# Altium schematic sheet triac.SchDoc
size A4; SheetNumber: 1; SheetTotal: 1; SPICEModelCacheZXQXGXKZ: <root> / <DocumentId>ZXQXGXKZ</DocumentId> / </root>
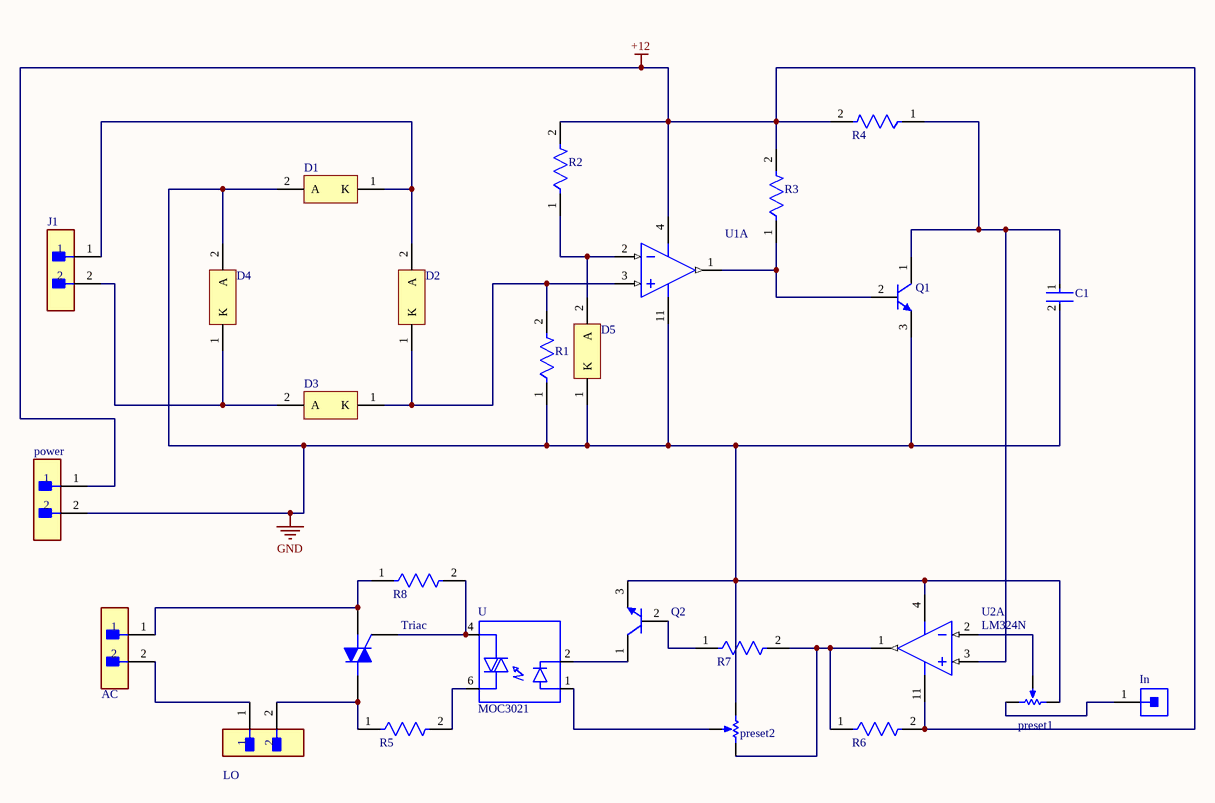
[diagram p0: triac.SchDoc]

## Parts
AC  M20-9990246  [FP-M20-9990246-MFG]  (value not drawn)
C1  RCE5C1H332J0M1H03A  [FP-RCE0K1-MFG]  (value not drawn)
D1  1N4007G  [ONSC-AXIAL_LEAD-2-59-10_P]  (value not drawn)
D2  1N4007G  [ONSC-AXIAL_LEAD-2-59-10_P]  (value not drawn)
D3  1N4007G  [ONSC-AXIAL_LEAD-2-59-10_P]  (value not drawn)
D4  1N4007G  [ONSC-AXIAL_LEAD-2-59-10_P]  (value not drawn)
D5  1N4007G  [ONSC-AXIAL_LEAD-2-59-10_P]  (value not drawn)
In  61300111121  [61300111121]  (value not drawn)
J1  M20-9990246  [FP-M20-9990246-MFG]  (value not drawn)
LO  M20-9990246  [FP-M20-9990246-MFG]  (value not drawn)
power  M20-9990246  [FP-M20-9990246-MFG]  (value not drawn)
preset1  3362P-1-103LF  [BOUR-3362P]  (value not drawn)
preset2  3362P-1-103LF  [BOUR-3362P]  (value not drawn)
Q1  BC547BG  [ONSC-TO-92-3-29-11]  (value not drawn)
Q2  BC547BG  [ONSC-TO-92-3-29-11]  (value not drawn)
R1  MFR-25FBF52-1K18  [FP-MFR-25-MFG]  (value not drawn)
R2  MFR-25FBF52-1K18  [FP-MFR-25-MFG]  (value not drawn)
R3  MFR-25FBF52-1K18  [FP-MFR-25-MFG]  (value not drawn)
R4  MFR-25FBF52-1K18  [FP-MFR-25-MFG]  (value not drawn)
R5  MFR-25FBF52-1K18  [FP-MFR-25-MFG]  (value not drawn)
R6  MFR-25FBF52-1K18  [FP-MFR-25-MFG]  (value not drawn)
R7  MFR-25FBF52-1K18  [FP-MFR-25-MFG]  (value not drawn)
R8  MFR-25FBF52-1K18  [FP-MFR-25-MFG]  (value not drawn)
Triac  Triac  [369-03]  (value not drawn)
U  MOC3021  [DIP762W45P254L889H508Q6]
U1  LM324N  [N0014A]  (value not drawn)  (part A of 4)
U2  LM324N  [N0014A]  (part A of 4)

## Nets
+12: power.1 R2.2 R3.2 R4.2 R6.2 U1.4(V+) U2.11(GND)
GND: C1.2 D1.2(A) D4.2(A) D5.1(K) power.2 preset1.1(CCW) preset2.1(CCW) Q1.3(E) Q2.3(E) R1.1 U1.11(GND) U2.4(V+)
NetAC_1: AC.1 R8.1 Triac.1(M1)
NetAC_2: AC.2 LO.1
NetC1_1: C1.1 Q1.1(C) R4.1 U2.3(IN1+)
NetD1_1: D1.1(K) D2.2(A) J1.1
NetD2_1: D2.1(K) D3.1(K) R1.2 U1.3(IN1+)
NetD3_2: D3.2(A) D4.1(K) J1.2
NetD5_2: D5.2(A) R2.1 U1.2(IN1-)
NetIn_1: In.1 preset1.3(CW)
NetLO_2: LO.2 R5.1 Triac.2(M2)
Netpreset1_2: preset1.2(S) U2.2(IN1-)
Netpreset2_2: preset2.2(S) U.1(ANODE)
Netpreset2_3: preset2.3(CW) R6.1 R7.2 U2.1(OUT1)
NetQ1_2: Q1.2(B) R3.1 U1.1(OUT1)
NetQ2_1: Q2.1(C) U.2(CATODE)
NetQ2_2: Q2.2(B) R7.1
NetR5_2: R5.2 U.6(MAIN_TERM1)
NetR8_2: R8.2 Triac.3(G) U.4(MAIN_TERM2)

## Library data of the parts
AC J1 LO power = CMP-15831-000009-1: CONN HEADER VERT 2POS 2.54MM; Manufacturer: Harwin; Conn Gender: Male; Conn Orientation: Vertical; Number Of Contacts: 2; Current Rating: 3A; ComponentLink2URL: https://cdn.harwin.com/pdfs/M20-999.pdf; ComponentLink2Description: Datasheet; Package: M20-9990246; Temperature: -40°C to +105°C; Octopart: https://octopart.com/m20-9990246-harwin-2590635; Mouser Description: 2.54mm (0.1") Pitch SIL Vertical PC Tail Pin Header, 6.1mm mating pin height, tin, 2 contacts; Temperature Range High: +105°C; Device Class L1: Connectors; RoHS: TRUE; Automotive: No; Height: 8.99mm; Number Of Rows: 1; Contact Material: Tin,Nickel; Category: Conn; Pitch: 2.54mm; Lead Free: Yes; Digikey Description: CONN HEADER VERT 2POS 2.54MM; Manufacturer Part Number: M20-9990246; Temperature Range Low: -40°C; Device Class L3: unset; Device Class L2: Headers and Wire Housings
C1 = CMP-06035-032713-1: Cap Ceramic 3.3nF 50V C0G ±5% Radial 5mm +125°C Automotive Bulk; Lead Diameter: 0.5mm; Lead/Base Style: Formed Leads; Voltage Rating (DC): 50V; Dielectric: C0G; Capacitance: 3.3nF; Mount: Through Hole; Width: 0.098inch; Max Operating Temperature: 125°C; Height - Seated (Max): 0.138inch; Packaging: Tape and Reel; Package Quantity: 2000; Case/Package: Radial; Tolerance: 5%; Voltage Rating: 50V; Termination: Radial; Length: 0.142inch; Ratings: AEC-Q200; Lead Pitch: 0.197inch; Min Operating Temperature: -55°C; Height: 3.5mm; Resistor Type: Ceramic
D1-D5 = CMP-0902-00143-1: Standard Recovery Rectifier, 2-Pin Axial_Lead, Pb-Free, Bulk Bag; Manufacturer: On Semiconductor; VRRM Max (V): 1000; IFSM Max (A): 30; IO(rec) Max (A): 1; ComponentLink2Description: Datasheet; ComponentLink2URL: http://www.onsemi.com/pub_link/Collateral/1N4001-D.PDF; PackageDescription: 2-Pin, Axial Lead, Diameter 2.35 mm; PartNumber: 1N4007G; ComponentLink1URL: http://www.onsemi.com/; ComponentLink3URL: http://www.onsemi.cn/pub_link/Collateral/59-10.PDF; PackageReference: AXIAL_LEAD-2-59-10; ComponentLink1Description: Manufacturer URL; Mounting Technology: Through Hole; ComponentLink3Description: Package Specification; Packing: Bulk Bag; PackageVersion: Rev. U, 02/2005; DatasheetVersion: Rev. 13; RoHS: TRUE; Type: Standard Recovery
In = CMP-1502-01058-1: THT Vertical Pin Header WR-PHD, Pitch 2.54 mm, Single Row, 1 pins; Manufacturer: Wurth Elektronik; Gender: Male; Working Voltage: 250VAC; Withstanding Voltage: 500VAC; Pin Number: 1; Contact Resistance: 20mOhm; Rated Current: 3A; Pitch: 2.54mm; Mounting Technology: THT; Datasheet URL: https://katalog.we-online.de/em/datasheet/6130xx11121.pdf; Manufacturer URL: http://www.we-online.de; Operating Temperature: -40to105degC; Publisher: WurthElektronik; Part Number: 61300111121; Row Number: Single; Package Reference: 61300111121; Orientation: Vertical; Packaging: Bag
preset1 preset2 = CMP-1747-00004-1: Square Trimpot(R) Trimming Potentiometer, 10 KOhm, 300 V, -55 to 125 degC, 3-Pin THD, RoHS, Tube; Voltage Rating: 220 mV; Power Rating: 1 W; Tolerance: 1%; Resistance: 50 mohm; Case/Package: 1206; Length: 3.2 mm; RoHSCompliant: True; PackageDescription: 3-Pin Through Hole Device, Body 6.6 x 6.99 mm, Pitch 2.54 mm; ComponentLink2Description: Datasheet; REACH SVHC: No SVHC; Mount: Surface Mount; Height: 0.6 mm; Packaging: Tape and Reel; ComponentLink1URL: http://www.bourns.com/; Case Code (Imperial): 0612; Pins: 2; Case Code (Metric): 1632; ComponentLink2URL: http://www.bourns.com/docs/Product-Datasheets/3362.pdf; Min Operating Temperature: -25degC; ComponentLink1Description: Manufacturer URL; PackageReference: 3326P; Max Operating Temperature: 125degC; Width: 1.6 mm; Package Quantity: 5000; DatasheetVersion: May-16
Q1 Q2 = CMP-1048-01469-1: Amplifier Transistor, NPN Silicon, 3-Pin TO-92, Pb-Free, Bulk Box; Manufacturer: On Semiconductor; IC Continuous (A): 0.1; fT Min (MHz): 150; Packing: Bulk Box; RoHS: TRUE; PackageVersion: Rev. AM; Mounting Technology: Through Hole; Polarity: NPN; PackageReference: TO-92-3-29-11_AM_SL; DatasheetVersion: Rev. 7; ComponentLink2URL: http://www.onsemi.com/pub_link/Collateral/BC546-D.PDF; ComponentLink1Description: Manufacturer URL; ComponentLink3URL: http://www.onsemi.cn/pub_link/Collateral/2N6426-D.PDF; PackageDescription: 3-Pin Transistor Outline, Body 4.825 x 3.685 mm, Pitch 1.27 mm; ComponentLink2Description: Datasheet; ComponentLink1URL: http://www.onsemi.com/; PartNumber: BC547BG; ComponentLink3Description: Package Specification
R1-R8 = CMP-03413-000001-1: RES 1.18K OHM 1/4W 1% AXIAL; Manufacturer: Yageo; Value: 1.18kΩ; Temperature Coefficient: 100ppm/°C; Power Rating: 0.25W; Voltage Rating: 250V; Temperature: -55°C to +155°C; Automotive: No; Temperature Range High: +155°C; Mouser Description: Metal Film Resistors 1.18K OHM 1/4W 1%; Digikey Description: RES 1.18K OHM 1/4W 1% AXIAL; Lead Free: Yes; Tolerance: 1%; ComponentLink2Description: Datasheet; ComponentLink2URL: https://www.yageo.com/upload/media/product/products/datasheet/lr/Yageo_LR_MFR_1.pdf; Temperature Range Low: -55°C; Package: MFR-25; Ipc Land Pattern Name: RESAD1000W75L680D260; Composition: Metal Film; Category: Res; Octopart: https://octopart.com/mfr-25fbf52-1k18-yageo-56251681; Series: MFR; Device Class L2: Resistors; Height: 2.6mm; Resistance: 1.18kΩ; Device Class L3: Through-Hole Resistors; Manufacturer Part Number: MFR-25FBF52-1K18; RoHS: TRUE; Device Class L1: Passive Components
Triac = Triac: Silicon Bidirectional Triode Thyristor; Note: Pin 2 is electrically connected to Pin 4 (TAB); Published: 29-Sep-2000; LatestRevisionDate: 17-Jul-2002; LatestRevisionNote: Re-released for DXP Platform.; DatasheetVersion: 1999; PackageReference: 369-03; Publisher: Altium Limited; PackageDescription: TO, Thru-Hole, Vertical, Heatsink Mounted; 3 In-Line Leads; Pitch 2.28 mm; ComponentLink1Description: Manufacturer Link; ComponentLink1URL: http://www.motorola.com/
U = MOC3021: Optoisolator Triac Output 5000Vrms 1 Channel 6-DIP; MF: Lite-On; MP: MOC3021; SnapEDA_Link: https://www.snapeda.com/parts/MOC3021/Lite-On/view-part/4551083/?ref=snap; Availability: Unavailable; Package: DIP-6 Lite-On; Value: *; Price: None
U1 U2 = CMP-0055-00082-3: Low Power Quad Operational Amplifier, 14-pin MDIP; Manufacturer: Texas Instruments; CompType: Amplifiers; PowerWise: N; PackageTopMarking: NSUZXYYTTE#*LM324N; PackageDescription: MDIP, .750 x .250 x.130in, 14 Lead, .100in Pitch; Package Reference: N0014A; RoHS: N; Code_JEDEC: MS-001-AA; ComponentLink1URL: http://www.ti.com/general/docs/lit/getliterature.tsp?genericPartNumber=LM324&fileType=pdf; ComponentLink1Description: Datasheet URL; PinCount: 14